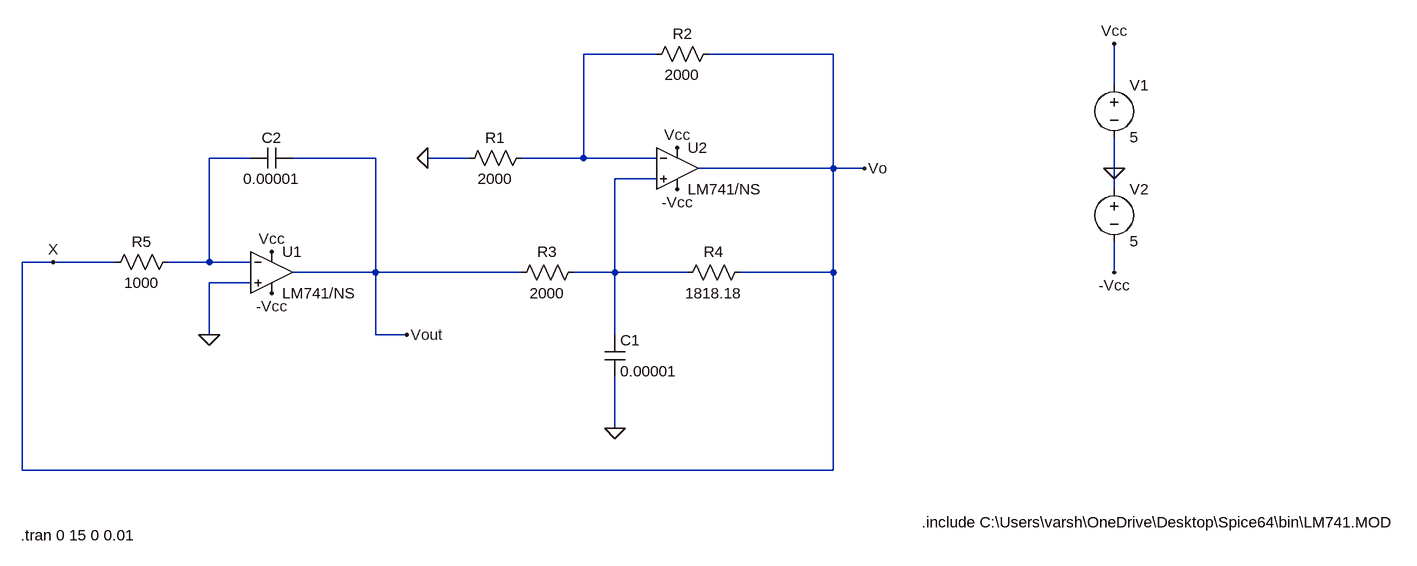
[diagram p0: schematic es17btech11009.asc]
es17btech11009.asc, the LTspice schematic file:
Version 4
SHEET 1 1232 712
WIRE 64 -48 -48 -48
WIRE 336 -48 144 -48
WIRE 768 0 768 -64
WIRE -560 112 -624 112
WIRE -368 112 -496 112
WIRE -224 112 -288 112
WIRE -48 112 -48 -48
WIRE -48 112 -144 112
WIRE 64 112 -48 112
WIRE 336 128 336 -48
WIRE 336 128 128 128
WIRE 384 128 336 128
WIRE 768 128 768 80
WIRE 64 144 0 144
WIRE 768 160 768 128
WIRE -864 272 -912 272
WIRE -768 272 -864 272
WIRE -624 272 -624 112
WIRE -624 272 -688 272
WIRE -560 272 -624 272
WIRE -368 288 -368 112
WIRE -368 288 -496 288
WIRE -144 288 -368 288
WIRE 0 288 0 144
WIRE 0 288 -64 288
WIRE 112 288 0 288
WIRE 336 288 336 128
WIRE 336 288 192 288
WIRE 768 288 768 240
WIRE -560 304 -624 304
WIRE -624 384 -624 304
WIRE -368 384 -368 288
WIRE -320 384 -368 384
WIRE 0 384 0 288
WIRE 0 528 0 448
WIRE -912 592 -912 272
WIRE 336 592 336 288
WIRE 336 592 -912 592
FLAG 768 128 0
FLAG -288 112 0
FLAG 0 528 0
FLAG 768 -64 Vcc
FLAG 96 96 Vcc
FLAG 768 288 -Vcc
FLAG 96 160 -Vcc
FLAG -528 256 Vcc
FLAG -528 320 -Vcc
FLAG -624 384 0
FLAG -320 384 Vout
FLAG -864 272 X
FLAG 384 128 Vo
SYMBOL res -128 96 R90
WINDOW 0 0 56 VBottom 2
WINDOW 3 32 56 VTop 2
SYMATTR InstName R1
SYMATTR Value 2000
SYMBOL res 160 -64 R90
WINDOW 0 0 56 VBottom 2
WINDOW 3 32 56 VTop 2
SYMATTR InstName R2
SYMATTR Value 2000
SYMBOL res -48 272 R90
WINDOW 0 0 56 VBottom 2
WINDOW 3 32 56 VTop 2
SYMATTR InstName R3
SYMATTR Value 2000
SYMBOL res 208 272 R90
WINDOW 0 0 56 VBottom 2
WINDOW 3 32 56 VTop 2
SYMATTR InstName R4
SYMATTR Value 1818.18
SYMBOL cap -16 384 R0
SYMATTR InstName C1
SYMATTR Value 0.00001
SYMBOL voltage 768 -16 R0
WINDOW 123 0 0 Left 0
WINDOW 39 0 0 Left 0
SYMATTR InstName V1
SYMATTR Value 5
SYMBOL voltage 768 144 R0
WINDOW 123 0 0 Left 0
WINDOW 39 0 0 Left 0
SYMATTR InstName V2
SYMATTR Value 5
SYMBOL cap -496 96 R90
WINDOW 0 0 32 VBottom 2
WINDOW 3 32 32 VTop 2
SYMATTR InstName C2
SYMATTR Value 0.00001
SYMBOL res -672 256 R90
WINDOW 0 0 56 VBottom 2
WINDOW 3 32 56 VTop 2
SYMATTR InstName R5
SYMATTR Value 1000
SYMBOL Opamps\\opamp2 -528 224 R0
SYMATTR InstName U1
SYMATTR Value LM741/NS
SYMBOL Opamps\\opamp2 96 64 R0
SYMATTR InstName U2
SYMATTR Value LM741/NS
TEXT 472 672 Left 2 !.include C:\\Users\\varsh\\OneDrive\\Desktop\\Spice64\\bin\\LM741.MOD
TEXT -914 692 Left 2 !.tran 0 15 0 0.01

The netlist it stands for:
* es17btech11009.asc
R1 N001 0 2000
R2 Vo N001 2000
R3 N003 Vout 2000
R4 Vo N003 1818.18
C1 N003 0 0.00001
V1 Vcc 0 5
V2 0 -Vcc 5
C2 Vout N002 0.00001
R5 N002 Vo 1000
XU1 0 N002 Vcc -Vcc Vout LM741/NS  ; pins In+ In- V+ V- OUT
XU2 N003 N001 Vcc -Vcc Vo LM741/NS  ; pins In+ In- V+ V- OUT
.include C:\Users\varsh\OneDrive\Desktop\Spice64\bin\LM741.MOD
.tran 0 15 0 0.01
.backanno
.end